# EAGLE design esp32camWithInfrared (EAGLE 9.6.2)
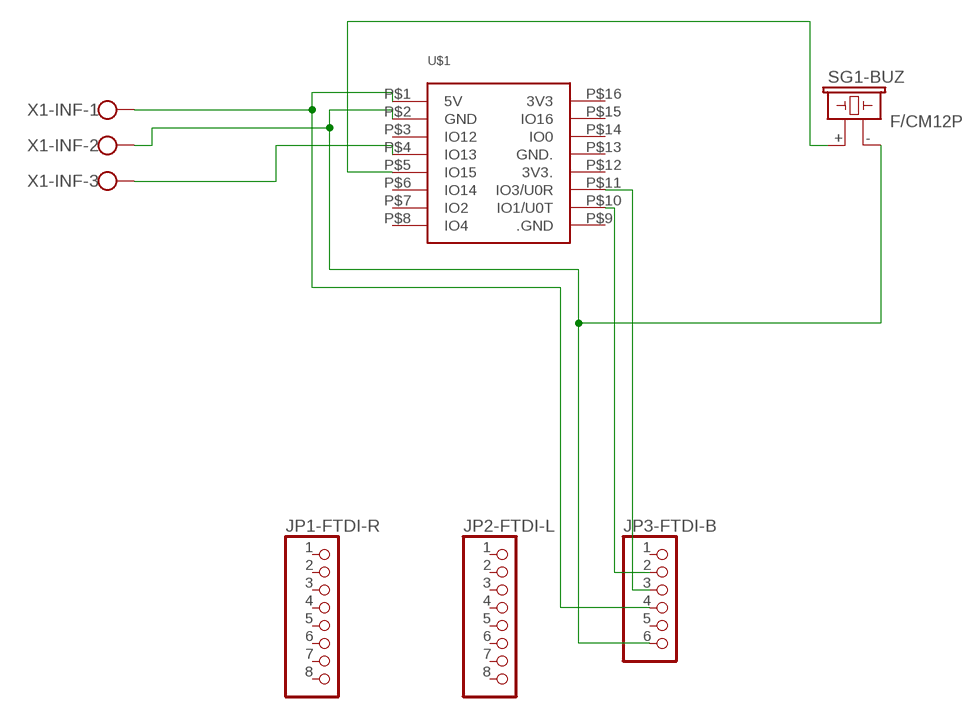
[diagram p0: schematic, sheet 1]

## Parts
JP1-FTDI-R  PINHD-1X8  [1X08]
JP2-FTDI-L  PINHD-1X8  [1X08]
JP3-FTDI-B  PINHD-1X6  [1X06]
SG1-BUZ  F/CM12P  [F/CM12P]
U$1  ESP32-CAM  [ESP32-CAM]
X1-INF  W237-103  [W237-103]

## Nets
N$1: JP3-FTDI-B.6 SG1-BUZ.- U$1.P$2(GND) X1-INF.2
N$2: JP3-FTDI-B.2 U$1.P$10(IO1/U0T)
N$3: JP3-FTDI-B.3 U$1.P$11(IO3/U0R)
N$4: JP3-FTDI-B.4 U$1.P$1(5V) X1-INF.1
N$5: SG1-BUZ.+ U$1.P$5(IO15)
N$7: U$1.P$4(IO13) X1-INF.3
Unconnected: JP1-FTDI-R.1 JP1-FTDI-R.2 JP1-FTDI-R.3 JP1-FTDI-R.4 JP1-FTDI-R.5 JP1-FTDI-R.6 JP1-FTDI-R.7 JP1-FTDI-R.8 JP2-FTDI-L.1 JP2-FTDI-L.2 JP2-FTDI-L.3 JP2-FTDI-L.4 JP2-FTDI-L.5 JP2-FTDI-L.6 JP2-FTDI-L.7 JP2-FTDI-L.8 JP3-FTDI-B.1 JP3-FTDI-B.5 U$1.P$3(IO12) U$1.P$6(IO14) U$1.P$7(IO2) U$1.P$8(IO4) U$1.P$9(.GND) U$1.P$12(3V3.) U$1.P$13(GND.) U$1.P$14(IO0) U$1.P$15(IO16) U$1.P$16(3V3)

## Library data of the parts
JP1-FTDI-R JP2-FTDI-L = pinhead:PINHD-1X8: PIN HEADER
JP3-FTDI-B = pinhead:PINHD-1X6: PIN HEADER
SG1-BUZ = buzzer:F/CM12P: BUZZER Source: Buerklin; OC_FARNELL: unknown; OC_NEWARK: unknown
U$1 = ESP32-CAM:ESP32-CAM: Check availability <https://pricing.snapeda.com/parts/ESP32-CAM/AI-Thinker/view-part?ref=eda>; AVAILABILITY: Not in stock; DESCRIPTION: ESP32 ESP32 Transceiver; 802.11 a/b/g/n (Wi-Fi, WiFi, WLAN), Bluetooth® Smart 4.x Low Energy (BLE) Evaluation Board; MF: AI-Thinker; MP: ESP32-CAM; PACKAGE: None; PRICE: None
X1-INF = con-wago-500:W237-103: WAGO SCREW CLAMP; MPN: 237-103; OC_FARNELL: unknown; OC_NEWARK: 18M7116

## Board
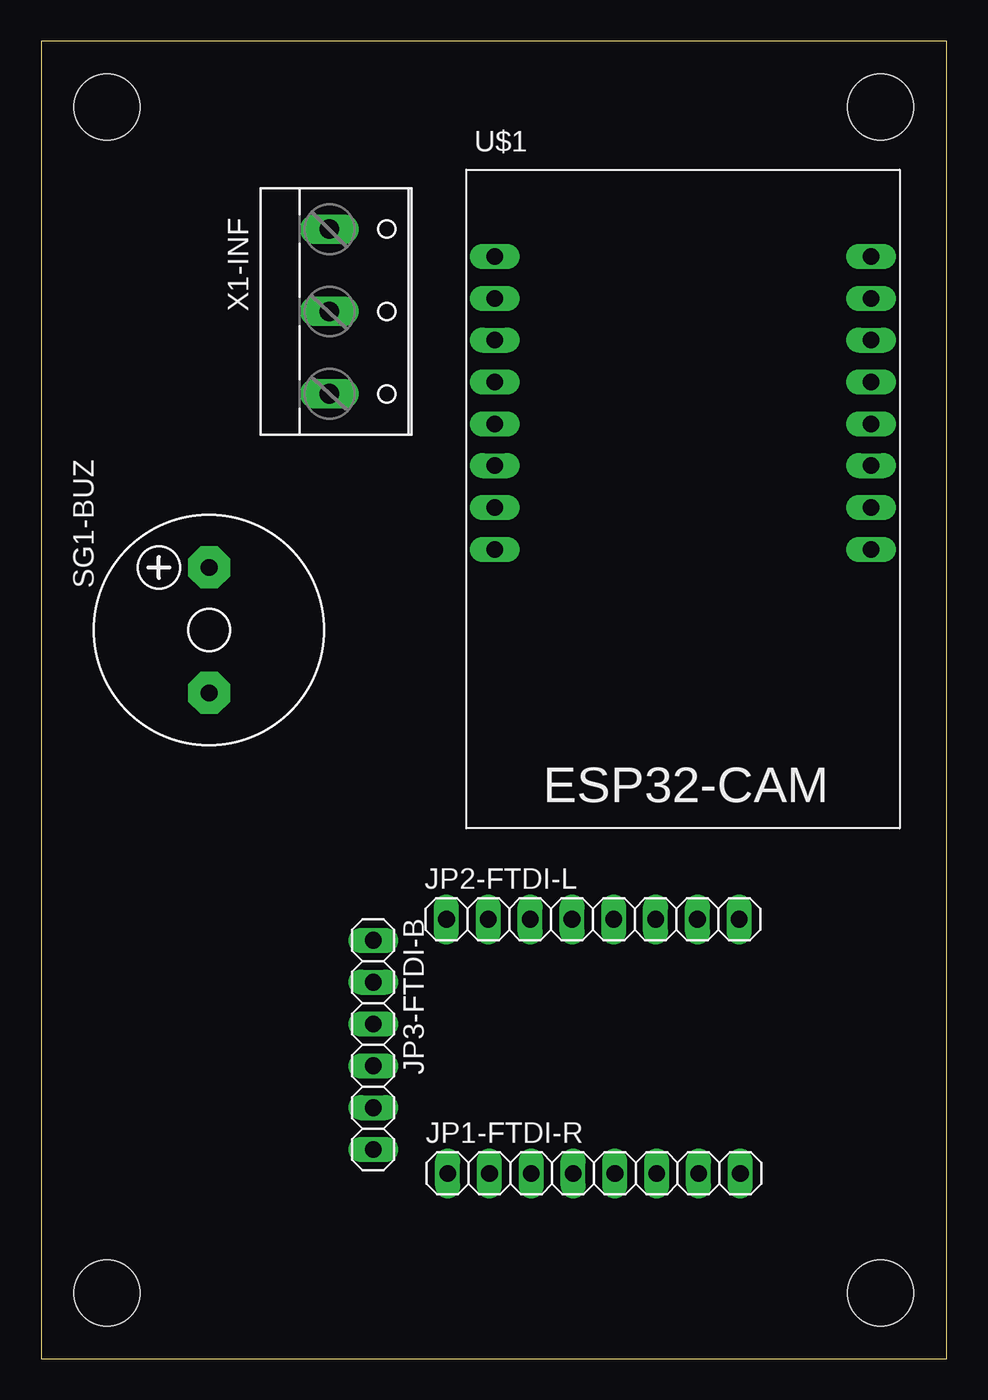
[diagram p1: board, top side]
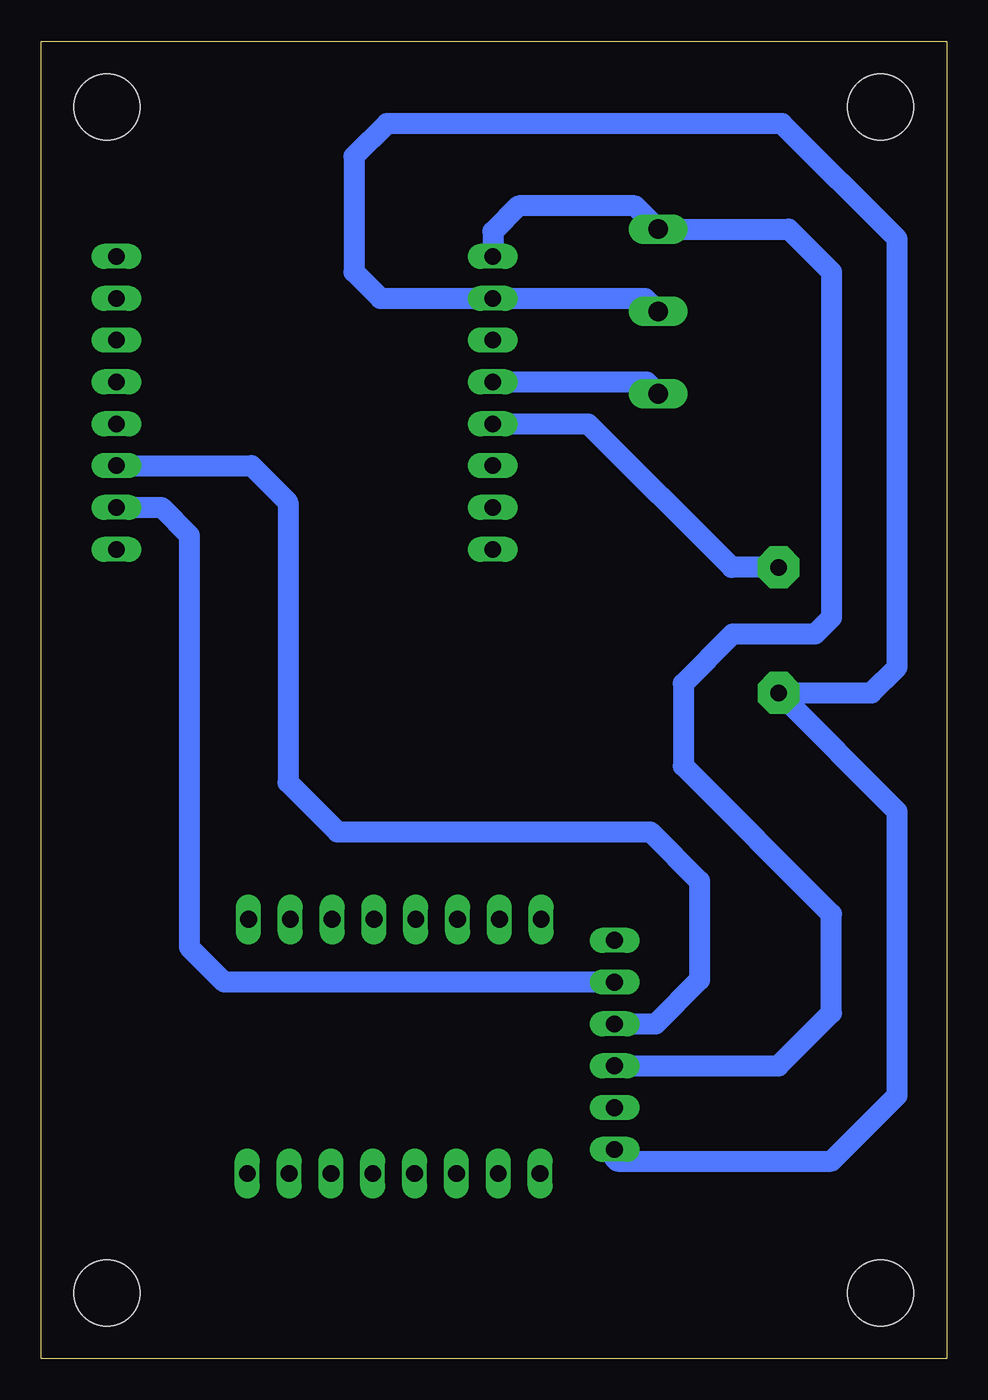
[diagram p2: board, bottom side, seen from below]

Size 55 x 80 mm. Coordinates in mm from the lower left corner, seen from the top.
Outline: 0,0 55,0 55,80 0,80 0,0
Copper layers (1*16): Top 0.035mm / dielectric 1.5mm / Bottom 0.035mm
Design rules "default": minimum track width 6mil, minimum drill 0.35mm, track to track 6mil, track to pad 6mil, pad to pad 6mil, via to via 6mil, smd to smd 6mil, copper to edge 40mil, drill to drill 6mil, minimum pad ring 10mil, minimum via ring 8mil, stop-mask expansion 4mil, vias tented up to drill 0mil, thermal gap 10mil
Holes 4 mm at 51,76 4,76 4,4 51,4

### Footprints (pad centres in the part's own frame; a part is rotated, then mirrored left to right if it is on the bottom)
1X08 = drill 1.016 long: 1 -8.89,0; 2 -6.35,0; 3 -3.81,0; 4 -1.27,0; 5 1.27,0; 6 3.81,0; 7 6.35,0; 8 8.89,0
1X06 = drill 1.016 long: 1 -6.35,0; 2 -3.81,0; 3 -1.27,0; 4 1.27,0; 5 3.81,0; 6 6.35,0
F/CM12P = drill 1.016 pad 2.54 octagon: + 3.81,0; - -3.81,0
ESP32-CAM = drill 1 pad 1.422 long: P$1 -11.43,10.16; P$2 -11.43,7.62; P$3 -11.43,5.08; P$4 -11.43,2.54; P$5 -11.43,0; P$6 -11.43,-2.54; P$7 -11.43,-5.08; P$8 -11.43,-7.62; P$9 11.43,-7.62; P$10 11.43,-5.08; P$11 11.43,-2.54; P$12 11.43,0; P$13 11.43,2.54; P$14 11.43,5.08; P$15 11.43,7.62; P$16 11.43,10.16
W237-103 = drill 1.194 long: 1 -5,-1.29; 2 0,-1.29; 3 5,-1.29

### Placement (x,y rotation side)
JP1-FTDI-R  33.58,11.26 0 top
JP2-FTDI-L  33.51,26.68 0 top
JP3-FTDI-B  20.17,19.06 270 top
SG1-BUZ  10.2,44.24 90 top
U$1  38.99,56.77 0 top
X1-INF  18.8,63.59 270 top

### Tracks (layer width: path | path; a pad name or v marks a point on that pad's centre or on a via)
N$1
  Bottom 1.27: JP3-FTDI-B.6 20.17,12.17 20,12 7,12 3,16 3,33.23 SG1-BUZ.- 4.57,40.43 3,42 3,68 10,75 34,75 36,73 36,66 34.39,64.39 U$1.P$2 18.31,64.39 X1-INF.2
N$2
  Bottom 1.27: JP3-FTDI-B.2 43.87,22.87 46,25 46,50 47.69,51.69 U$1.P$10
N$3
  Bottom 1.27: JP3-FTDI-B.3 17.67,20.33 15,23 15,29 18,32 37,32 40,35 40,52 42.23,54.23 U$1.P$11
N$4
  Bottom 1.27: U$1.P$1 27.56,68.44 26,70 18.92,70 X1-INF.1 9.59,68.59 7,66 7,45 8,44 13,44 16,41 16,36 7,27 7,21 10.21,17.79 JP3-FTDI-B.4
N$5
  Bottom 1.27: U$1.P$5 21.77,56.77 13.05,48.05 SG1-BUZ.+
N$7
  Bottom 1.27: U$1.P$4 18.23,59.31 X1-INF.3